# Altium schematic sheet Sheet1.SchDoc
size OrCAD B; SheetNumber: 1; SheetTotal: 1
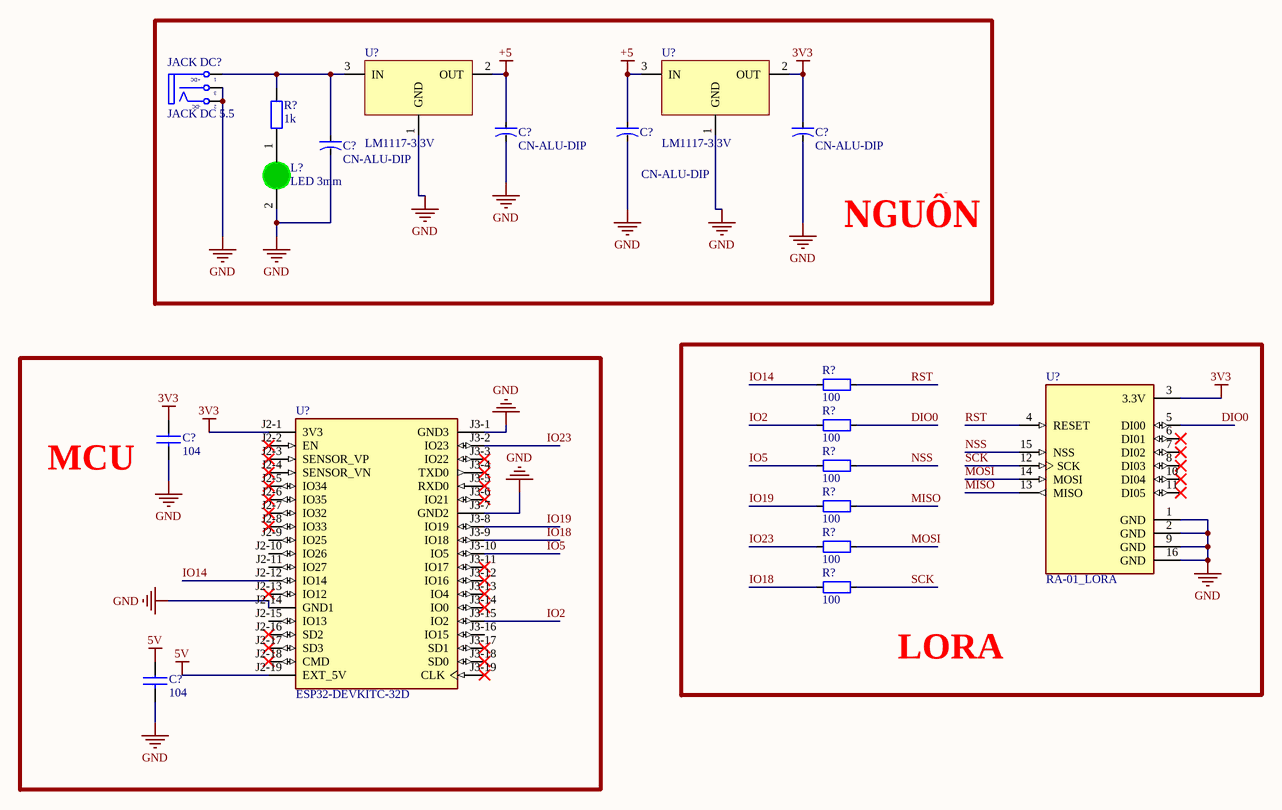
[diagram p0: Sheet1.SchDoc]

## Parts
(Parts that share a designator on the sheet are numbered #1, #2 ... from top to bottom, then left to right.)
C?#1  CN-ALU-DIP  [CA-ALU-2.54]
C?#2  CN-ALU-DIP  [CA-ALU-2.54]
C?#3  CN-ALU-DIP  [CA-ALU-2.54]
C?#4  CN-ALU-DIP  [CA-ALU-2.54]
C?#5  104  [CAP0603]
C?#6  104  [CAP0603]
JACK_DC?  JACK DC 5.5  [JACK DC 5.5]
L?  LED 3mm  [LED-3MM-GREEN]
R?#1  1k  [tro smd 0805]
R?#2  100  [RES-SMD-0805]
R?#3  100  [RES-SMD-0805]
R?#4  100  [RES-SMD-0805]
R?#5  100  [RES-SMD-0805]
R?#6  100  [RES-SMD-0805]
R?#7  100  [RES-SMD-0805]
U?#1  LM1117-3.3V  [SOT223-4N]
U?#2  LM1117-3.3V  [SOT223-4N]
U?#3  RA-01_LORA  [MODULE_RA-02_LORA]
U?#4  ESP32-DEVKITC-32D  [MODULE_ESP32-DEVKITC-32D]

## Blocks framed on the sheet
NGUỒN: C?#1-C?#4 JACK_DC? L? R?#1 U?#1 U?#2
LORA: R?#2-R?#7 U?#3
MCU: C?#5 C?#6 U?#4

## Nets
3V3: C?#3.1 C?#5.1 U?#2.2(OUT) U?#3.3(3.3V) U?#4.J2-1(3V3)
5V: C?#6.1 U?#4.J2-19(EXT_5V)
+5: C?#1.1 C?#2.1 U?#1.2(OUT) U?#2.3(IN)
GND: C?#1.2 C?#2.2 C?#3.2 C?#4.2 C?#5.2 C?#6.2 JACK_DC?.2(TN) JACK_DC?.3(S) L?.2(K) U?#1.1(GND) U?#2.1(GND) U?#3.1(GND) U?#3.2(GND) U?#3.9(GND) U?#3.16(GND) U?#4.J2-14(GND1) U?#4.J3-1(GND3) U?#4.J3-7(GND2)
DIO0: R?#3.2 U?#3.5(DI00)
IO2: R?#3.1 U?#4.J3-15(IO2)
IO5: R?#4.1 U?#4.J3-10(IO5)
IO14: R?#2.1 U?#4.J2-12(IO14)
IO18: R?#7.1 U?#4.J3-9(IO18)
IO19: R?#5.1 U?#4.J3-8(IO19)
IO23: R?#6.1 U?#4.J3-2(IO23)
MISO: R?#5.2 U?#3.13(MISO)
MOSI: R?#6.2 U?#3.14(MOSI)
NSS: R?#4.2 U?#3.15(NSS)
RST: R?#2.2 U?#3.4(RESET)
SCK: R?#7.2 U?#3.12(SCK)
NetC?#4_1: C?#4.1 JACK_DC?.1(T) R?#1.2 U?#1.3(IN)
NetL?_1: L?.1(A) R?#1.1

Not connected (* = marked no-connect by the designer): U?#3 6(DI01)* 7(DI02)* 8(DI03)* 10(DI04)* 11(DI05)*; U?#4 J2-2(EN)* J2-3(SENSOR_VP)* J2-4(SENSOR_VN)* J2-5(IO34)* J2-6(IO35)* J2-7(IO32)* J2-8(IO33)* J2-9(IO25) J2-10(IO26) J2-11(IO27) J2-13(IO12)* J2-15(IO13) J2-16(SD2)* J2-17(SD3)* J2-18(CMD)* J3-3(IO22)* J3-4(TXD0)* J3-5(RXD0)* J3-6(IO21)* J3-11(IO17)* J3-12(IO16)* J3-13(IO4)* J3-14(IO0)* J3-16(IO15) J3-17(SD1)* J3-18(SD0)* J3-19(CLK)*

## Notes on the sheet
- (in symbol JACK DC 5.5) +DC; -DC

## Library data of the parts
C?#1-C?#4 = CN-ALU-DIP: Capacitor (Semiconductor SIM Model); Value: 104; LatestRevisionDate: 17-Jul-2002; LatestRevisionNote: Re-released for DXP Platform.; PackageReference: C1206; Publisher: Altium Limited
C?#5 C?#6 = CC0603JRNPO9BN300: CAP CER 30PF 50V NPO 0603; Manufacturer: Yageo; Tolerance: ±5%; Temperature Coefficient: C0G, NP0; Notification: Current market demand for these product types have resulted in fluctuating and extending lead times. Lead times may differ.; Supplier 1: Digi-Key; Manufacturer Part Number: CC0603JRNPO9BN300; RoHS: RoHS Compliant; Category: Capacitors; Stock 1: 0; Pricing 1: 1=0.1, 10=0.041, 100=0.0182, 500=0.01302, 1000=0.01022 (USD); Packaging: Cut Tape (CT); Part Status: Active; Voltage - Rated: 50V; Operating Temperature: -55°C ~ 125°C; Features: -; Ratings: -; Applications: General Purpose; Failure Rate: -; Mounting Type: Surface Mount, MLCC; Package / Case: 0603 (1608 Metric); Size / Dimension: 0.063" L x 0.032" W (1.60mm x 0.80mm); Height - Seated (Max): -; Thickness (Max): 0.035" (0.90mm); Lead Spacing: -; Lead Style: -; ComponentLink1URL: http://www.yageo.com/documents/recent/UPY-GP_NP0_16V-to-50V_16.pdf; ComponentLink1Description: http://www.yageo.com/documents/recent/UPY-GP_NP0_16V-to-50V_16.pdf; Supplier Part Number 1: 311-3357-1-ND
JACK_DC? = JACK DC 5.5: Value: Jac DC
L? = LED 3mm Xanh La: Cắm; Don_Vi: Con; Ma_Hang: MH001054; Ten_Linh_Kien: Led 3MM Phủ Xanh (10c); Ghi_Chu: *; Kieu_Chan: *; Chung_Loai: Cắm
R?#1 = Tro 0805 1% 1k: Dán; Don_Vi: Con; So_Chan: 2; Ten_Linh_Kien: Trở 0805 1% 1k; Ma_Hang: MH005468; Chung_Loai: Dán; Kieu_Chan: *
R?#2-R?#7 = Resistor - SMD: Resistor; Manufacturer: Generic Components; Class: Passive; Published: 08/06/2000; Publisher: Altium Hobart Technology Centre
U?#1 U?#2 = LM1117: 800mA Low-Dropout Linear Regulator; Creator: Nguyen Ba Bien; Website: http://group3i.net
U?#3 = RA-02_LORA: Ra-02 LoRa RF M5Stack Platform Evaluation Expansion Board; Price: None; Availability: Unavailable; MP: RA-02_LORA; Value: *; Package: None
U?#4 = ESP32-DEVKITC-32D: WiFi Development Tools (802.11) ESP32 General Development Kit, ESP32-WROOM-32D on the board; MF: Espressif Systems; SnapEDA_Link: https://www.snapeda.com/parts/ESP32-DEVKITC-32D/Espressif+Systems/view-part/?ref=snap; Package: None; Value: *; MP: ESP32-DEVKITC-32D; Check_prices: https://www.snapeda.com/parts/ESP32-DEVKITC-32D/Espressif+Systems/view-part/?ref=eda